# EAGLE design Ring Controller (EAGLE 9.6.2)
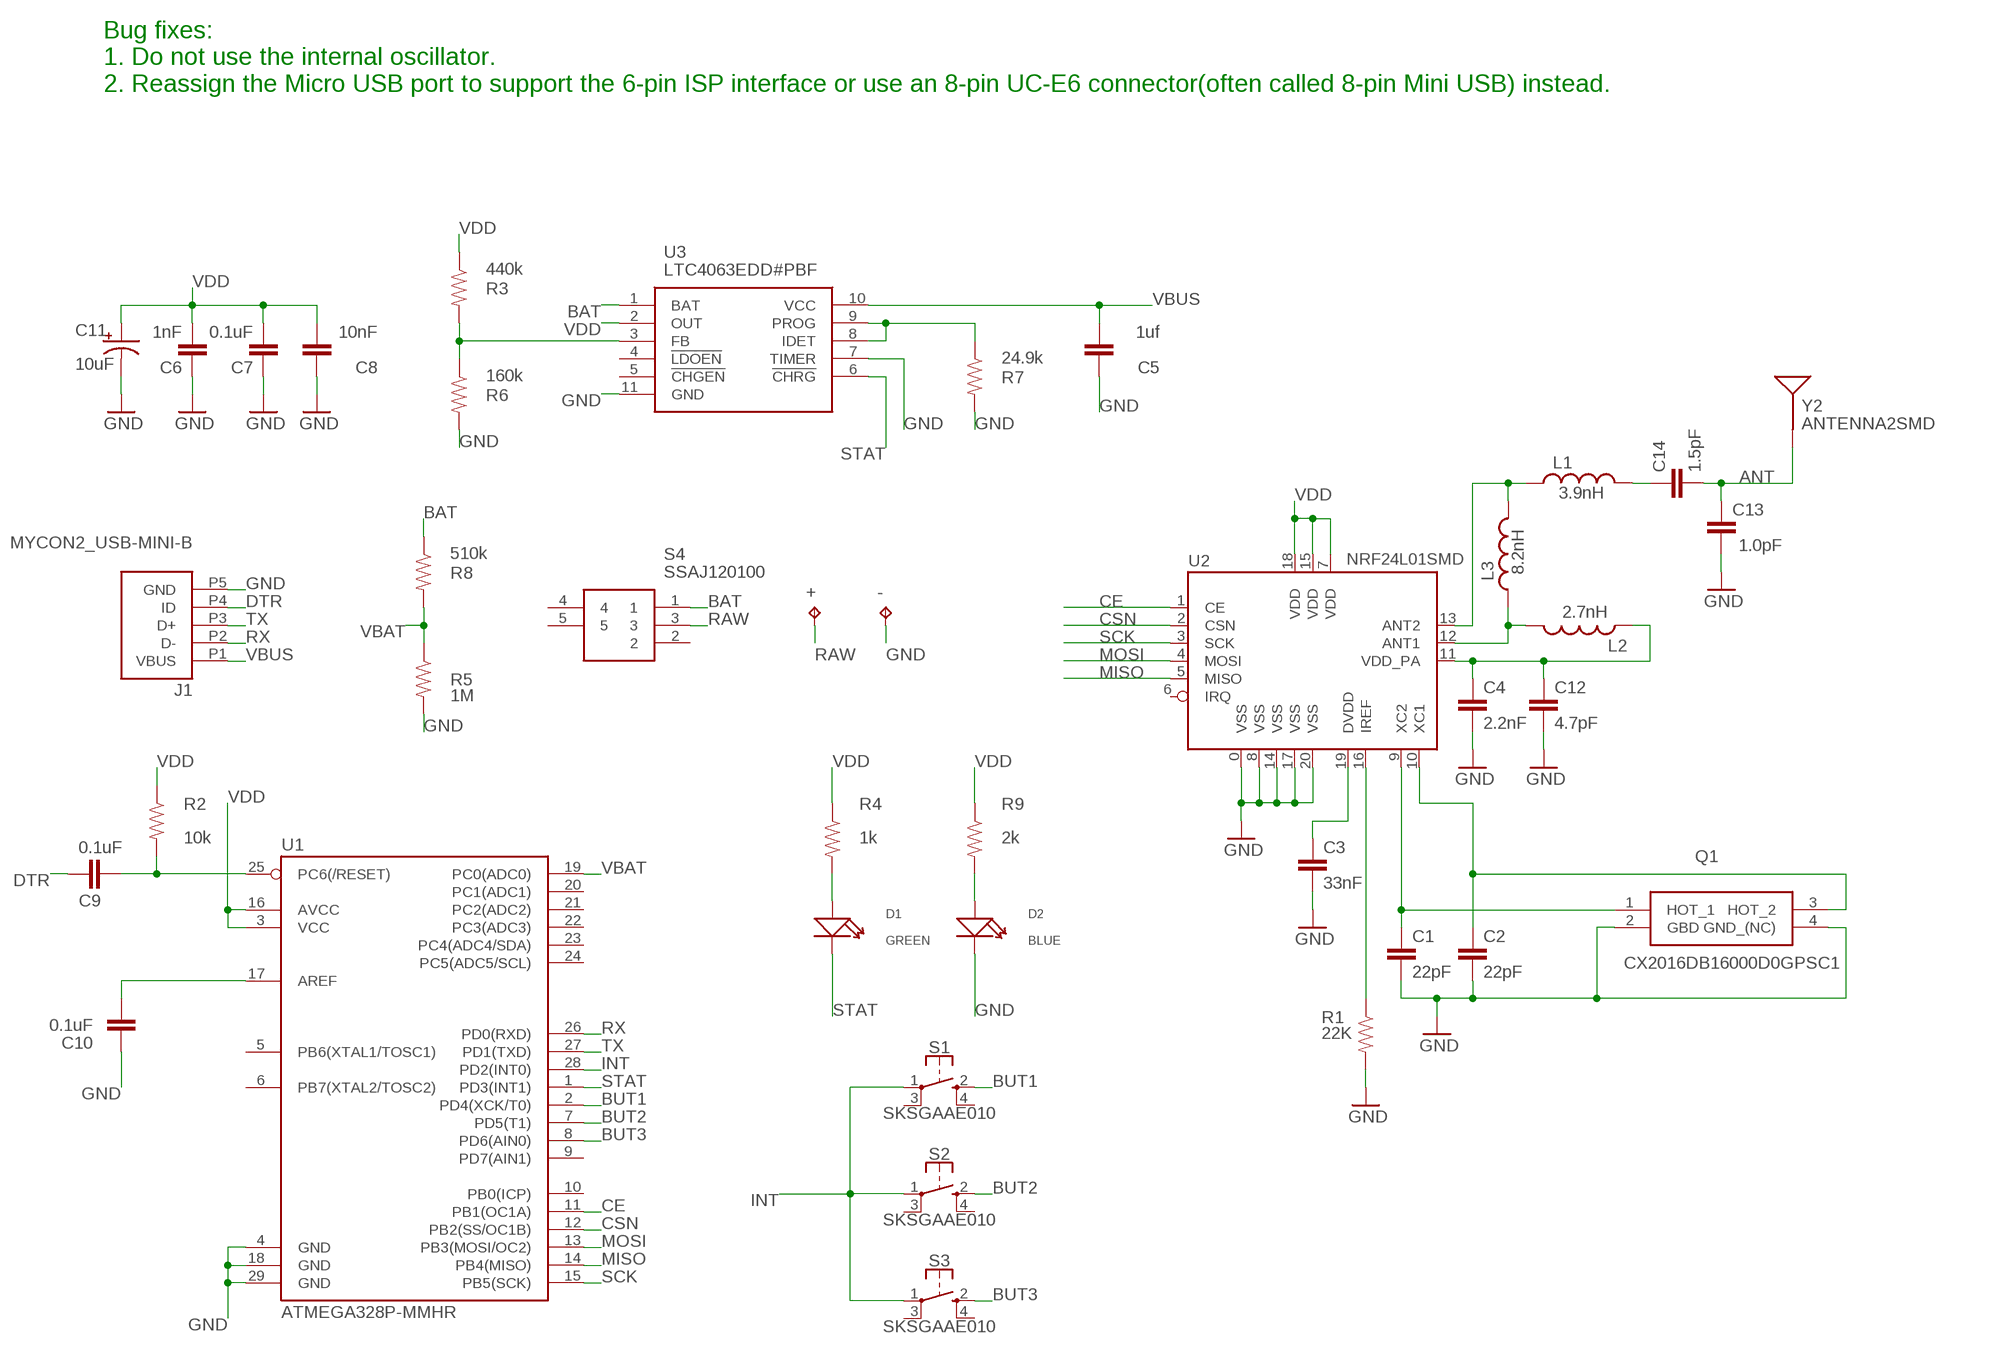
[diagram p0: schematic, sheet 1]

## Parts
+  TPB1,27  [B1,27]
-  TPB1,27  [B1,27]
C1  22pF  CAP0402-CAP  [0402-CAP]
C2  22pF  CAP0402-CAP  [0402-CAP]
C3  33nF  CAP0402-CAP  [0402-CAP]
C4  2.2nF  CAP0402-CAP  [0402-CAP]
C5  1uf  CAP0402-CAP  [0402-CAP]
C6  1nF  CAP0402-CAP  [0402-CAP]
C7  0.1uF  CAP0402-CAP  [0402-CAP]
C8  10nF  CAP0402-CAP  [0402-CAP]
C9  0.1uF  CAP0402-CAP  [0402-CAP]
C10  0.1uF  CAP0402-CAP  [0402-CAP]
C11  10uF  10UF-POLAR-0603-6.3V-20%(TANT)  [0603-POLAR]
C12  4.7pF  CAP0402-CAP  [0402-CAP]
C13  1.0pF  CAP0402-CAP  [0402-CAP]
C14  1.5pF  CAP0402-CAP  [0402-CAP]
D1  GREEN  SMD-LED-CLEAR-BLUE(0402)  [LED-0402]
D2  BLUE  SMD-LED-CLEAR-BLUE(0402)  [LED-0402]
J1  MYCON2_USB-MINI-B  [CON2_USB_MICRO_B_AT]
L1  3.9nH  INDUCTOR0402  [C0402]
L2  2.7nH  INDUCTOR0402  [C0402]
L3  8.2nH  INDUCTOR0402  [C0402]
Q1  CX2016DB16000D0GPSC1  [CX2016DB_1]
R1  22K  RESISTOR0402-RES  [0402-RES]
R2  10k  RESISTOR0402  [0402-RES]
R3  440k  RESISTOR0402  [0402-RES]
R4  1k  RESISTOR0402  [0402-RES]
R5  1M  RESISTOR0402  [0402-RES]
R6  160k  RESISTOR0402  [0402-RES]
R7  24.9k  RESISTOR0402  [0402-RES]
R8  510k  RESISTOR0402  [0402-RES]
R9  2k  RESISTOR0402  [0402-RES]
S1  SKSGAAE010  [SKSG]
S2  SKSGAAE010  [SKSG]
S3  SKSGAAE010  [SKSG]
S4  SSAJ120100  [SSAJ120100]
U1  ATMEGA328P-MMHR  [QFN45P400X400X100-29N]
U2  NRF24L01SMD  [QFN20-4X4MM]
U3  LTC4063EDD#PBF  [SON50P300X300X80-11N]
Y2  ANTENNA2SMD  [ANTENNA-CHIP2]

## Nets
ANT: C13.2 C14.2 Y2.FEED(SIGNAL)
BAT: R8.1 S4.1 U3.1(BAT)
BUT1: S1.2 U1.2(PD4(XCK/T0))
BUT2: S2.2 U1.7(PD5(T1))
BUT3: S3.2 U1.8(PD6(AIN0))
CE: U1.11(PB1(OC1A)) U2.1(CE)
CSN: U1.12(PB2(SS/OC1B)) U2.2(CSN)
DTR: C9.1 J1.P4(ID)
GND: -.TP C1.2 C2.2 C3.2 C4.2 C5.1 C6.1 C7.1 C8.1 C10.1 C11.- C12.2 C13.1 D2.- J1.P5(GND) Q1.2(GBD) Q1.4(GND_(NC)) R1.2 R5.2 R6.2 R7.2 U1.4(GND) U1.18(GND) U1.29(GND) U2.0(VSS) U2.8(VSS) U2.14(VSS) U2.17(VSS) U2.20(VSS) U3.7(TIMER) U3.11(GND)
INT: S1.1 S2.1 S3.1 U1.28(PD2(INT0))
MISO: U1.14(PB4(MISO)) U2.5(MISO)
MOSI: U1.13(PB3(MOSI/OC2)) U2.4(MOSI)
N$1: C1.1 Q1.1(HOT_1) U2.9(XC2)
N$2: C2.1 Q1.3(HOT_2) U2.10(XC1)
N$3: L2.2 L3.1 U2.12(ANT1)
N$4: R1.1 U2.16(IREF)
N$5: C3.1 U2.19(DVDD)
N$6: L1.1 L3.2 U2.13(ANT2)
N$7: C4.1 C12.1 L2.1 U2.11(VDD_PA)
N$8: D1.+ R4.2
N$9: D2.+ R9.2
N$10: C14.1 L1.2
N$11: C10.2 U1.17(AREF)
N$12: R3.2 R6.1 U3.3(FB)
N$13: R7.1 U3.8(IDET) U3.9(PROG)
RAW: +.TP S4.3
RST: C9.2 R2.2 U1.25(PC6(/RESET))
RX: J1.P2(D-) U1.26(PD0(RXD))
SCK: U1.15(PB5(SCK)) U2.3(SCK)
STAT: D1.- U1.1(PD3(INT1)) U3.6(!CHRG)
TX: J1.P3(D+) U1.27(PD1(TXD))
VBAT: R5.1 R8.2 U1.19(PC0(ADC0))
VBUS: C5.2 J1.P1(VBUS) U3.10(VCC)
VDD: C6.2 C7.2 C8.2 C11.+ R2.1 R3.1 R4.1 R9.1 U1.3(VCC) U1.16(AVCC) U2.7(VDD) U2.15(VDD) U2.18(VDD) U3.2(OUT)
Unconnected: S1.3 S1.4 S2.3 S2.4 S3.3 S3.4 S4.2 S4.4 S4.5 U1.5(PB6(XTAL1/TOSC1)) U1.6(PB7(XTAL2/TOSC2)) U1.9(PD7(AIN1)) U1.10(PB0(ICP)) U1.20(PC1(ADC1)) U1.21(PC2(ADC2)) U1.22(PC3(ADC3)) U1.23(PC4(ADC4/SDA)) U1.24(PC5(ADC5/SCL)) U2.6(IRQ) U3.4(!LDOEN) U3.5(!CHGEN)

## Notes on the sheet
- Bug fixes:
  1. Do not use the internal oscillator.
  2. Reassign the Micro USB port to support the 6-pin ISP interface or use an 8-pin UC-E6 connector(often called 8-pin Mini USB) instead.

## Library data of the parts
+ - = testpad:TP: Test pad
C1-C4 C12-C14 = SparkFun:CAP: Capacitor Standard 0603 ceramic capacitor, and 0.1" leaded capacitor.
C5-C10 = SparkFun-Passives:CAP: Capacitor Standard 0603 ceramic capacitor, and 0.1" leaded capacitor.; PROD_ID: CAP-00868
C11 = SparkFun-Capacitors:10UF-POLAR: 10.0µF polarized capacitors A capacitor is a passive two-terminal electrical component used to store electrical energy temporarily in an electric field.; PROD_ID: CAP-13210
D1 D2 = Seeed-LED:SMD-LED-CLEAR-BLUE(0402): 304090075; MPN: BL-HB337A-AV-TRB; VALUE: BLUE-0402
J1 = SmartPrj:MYCON2_USB-MINI-B; SPICEPREFIX: X
L1-L3 = SparkFun:INDUCTOR: Inductors Basic Inductor/Choke - 0603 and 1206. Footprints are not proven and vary greatly between part numbers.
Q1 = 2016xtal:CX2016DB16000D0GPSC1: Crystals AEC-Q200 16MHz 8pF 2x1.6mm Source: Datasheet <http://media.digikey.com/pdf/Data Sheets/AVX PDFs/CX2016DB_USY1M-H1-16425-00_Spec.pdf>; DESCRIPTION: Crystals AEC-Q200 16MHz 8pF 2x1.6mm; HEIGHT: mm; MANUFACTURER_NAME: AVX; MANUFACTURER_PART_NUMBER: CX2016DB16000D0GPSC1; MOUSER_PART_NUMBER: 581-CX2016DB16000DPS; MOUSER_PRICE-STOCK: https://www.mouser.com/Search/Refine.aspx?Keyword=581-CX2016DB16000DPS
R1 = SparkFun:RESISTOR: Resistor Basic schematic elements and footprints for 0603, 1206, and PTH resistors.
R2-R9 = SparkFun-Resistors:RESISTOR: Resistor Basic schematic elements and footprints for 0603, 1206, and PTH resistors.; PROD_ID: RES-08698
S1-S3 = SKSGAAE010:SKSGAAE010: Black Button Tactile Switch, SPST-NO 50 mA 0.4mm Surface Mount Source: Datasheet <http://uk.rs-online.com/web/p/products/9173829>; DESCRIPTION: Black Button Tactile Switch, SPST-NO 50 mA 0.4mm Surface Mount; HEIGHT: mm; MANUFACTURER_NAME: ALPS; MANUFACTURER_PART_NUMBER: SKSGAAE010; MOUSER_PART_NUMBER: 688-SKSGAAE010; MOUSER_PRICE-STOCK: https://www.mouser.com/Search/Refine.aspx?Keyword=688-SKSGAAE010
S4 = SSAJ120100:SSAJ120100: Slide Switches 1-pole 2-positions Surface Mount Slide Switch SPDT Maintained 10 mA Slide Source: Datasheet <http://www.farnell.com/datasheets/1582290.pdf>; DESCRIPTION: Slide Switches 1-pole 2-positions Surface Mount Slide Switch SPDT Maintained 10 mA Slide; HEIGHT: mm; MANUFACTURER_NAME: ALPS; MANUFACTURER_PART_NUMBER: SSAJ120100; MOUSER_PART_NUMBER: 688-SSAJ120100; MOUSER_PRICE-STOCK: https://www.mouser.com/Search/Refine.aspx?Keyword=688-SSAJ120100; RS_PART_NUMBER: 1238892; RS_PRICE-STOCK: http://uk.rs-online.com/web/p/products/1238892
U1 = ATMEGA328P-MMHR:ATMEGA328P-MMHR: 8-bit Microcontrollers - MCU AVR 32K FL 2K SRAM 1KB EE 20 MHZ GRN Source: Datasheet <http://ww1.microchip.com/downloads/en/DeviceDoc/Atmel-42735-8-bit-AVR-Microcontroller-ATmega328-328P_Summary.pdf>; DESCRIPTION: 8-bit Microcontrollers - MCU AVR 32K FL 2K SRAM 1KB EE 20 MHZ GRN; HEIGHT: 1mm; MANUFACTURER_NAME: Microchip; MANUFACTURER_PART_NUMBER: ATMEGA328P-MMHR; MOUSER_PART_NUMBER: 556-ATMEGA328P-MMHR; MOUSER_PRICE-STOCK: https://www.mouser.com/Search/Refine.aspx?Keyword=556-ATMEGA328P-MMHR
U2 = SparkFun-RF:NRF24L01: Nordic nrf24L01 2.4GHz Low-power Transceiver This is the very popular, low cost, very low power RF transceiver from Nordic Semiconductor. Simple SPI interface. SparkFun Products 2.4GHz Transceiver IC - nRF24L01+ <https://www.sparkfun.com/products/690> (COM-00690) SparkFun Transceiver Breakout - nRF24L01+ (RP-SMA) <https://www.sparkfun.com/products/705> (WRL-00705) SparkFun Transceiver Breakout - nRF24L01+ <https://www.sparkfun.com/products/691> (COM-00691); PROD_ID: IC-08950; SF_ID: COM-00690
U3 = LTC4063EDD#PBF:LTC4063EDD#PBF: LINEAR TECHNOLOGY - LTC4063EDD#PBF - IC, BATT CHARGER, W/MP LDO, 10DFN Source: Datasheet <http://cds.linear.com/docs/en/datasheet/4063fc.pdf>; DESCRIPTION: LINEAR TECHNOLOGY - LTC4063EDD#PBF - IC, BATT CHARGER, W/MP LDO, 10DFN; HEIGHT: 0.8mm; MANUFACTURER_NAME: Linear Technology; MANUFACTURER_PART_NUMBER: LTC4063EDD#PBF; MOUSER_PART_NUMBER: 584-LTC4063EDD#PBF; MOUSER_PRICE-STOCK: https://www.mouser.com/Search/Refine.aspx?Keyword=584-LTC4063EDD%23PBF
Y2 = SparkFun:ANTENNA2: Antenna Single endded antenna. Common with smaller chip antennas. CHIP4 package is the GPS Chip Antenna SKU: GPS-08418. CHIP5 package is 2.4GHz chip antenna SKU: WRL-00144.

## Net classes
0 sig: width 0.127 mm, drill 0.2 mm, clearance 0.089 mm

## Board
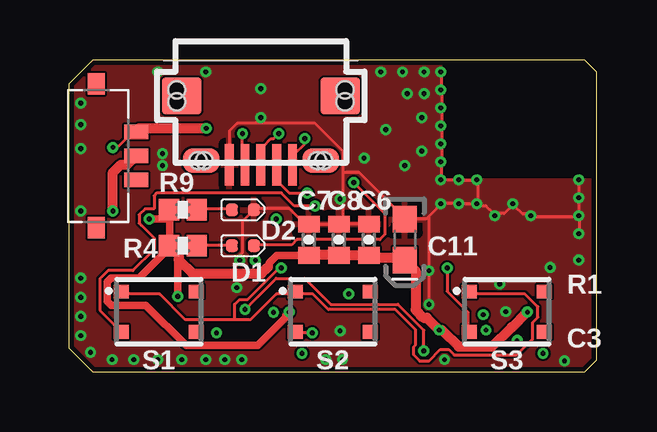
[diagram p1: board, top side]
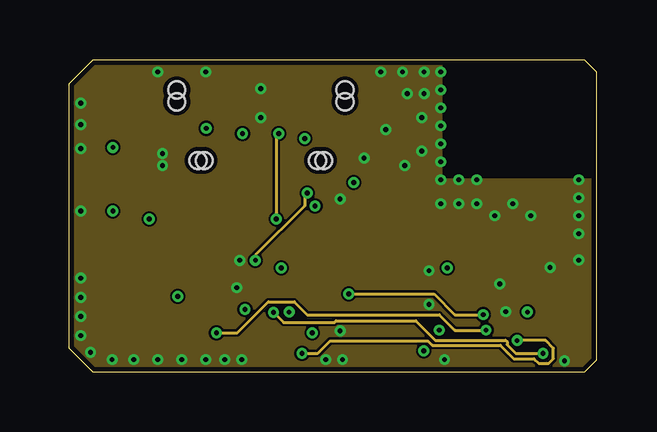
[diagram p2: board, inner layer Route2]
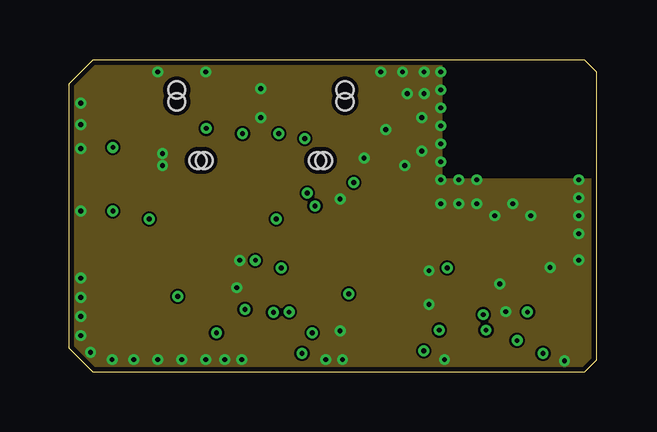
[diagram p3: board, inner layer Route15]
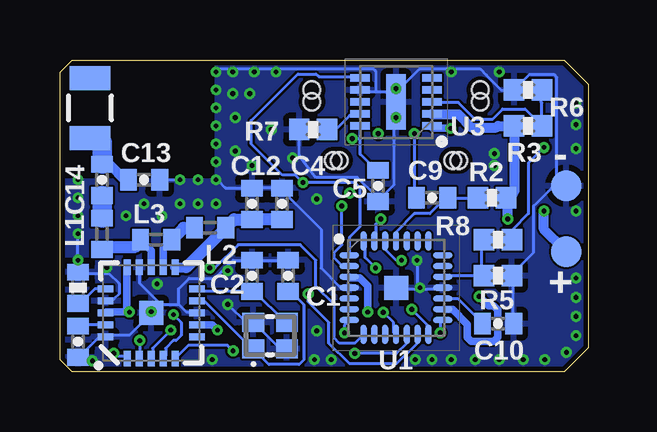
[diagram p4: board, bottom side, seen from below]

Size 22 x 13 mm. Coordinates in mm from the lower left corner, seen from the top.
Outline: 1,0 21.5,0 22,0.5 22,12.5 21.5,13 1,13 0,12 0,1 1,0
Copper layers (1+2*15+16): Top 0.035mm / dielectric 0.1mm / Route2 0.01mm / dielectric 0.61mm / Route15 0.01mm / dielectric 0.1mm / Bottom 0.035mm
Design rules "default *": minimum track width 3.5mil, minimum drill 0.2mm, track to track 3.5mil, track to pad 5mil, pad to pad 5mil, via to via 5mil, smd to smd 0mil, copper to edge 8mil, drill to drill 10mil, minimum pad ring 5mil, minimum via ring 5mil, stop-mask expansion 4mil, vias tented up to drill 8mil, thermal gap 10mil

### Footprints (pad centres in the part's own frame; a part is rotated, then mirrored left to right if it is on the bottom)
B1,27 = smd 1.27 x 1.27: TP 0,0
0402-CAP = smd 0.7 x 0.9: 1 -0.65,0; 2 0.65,0
0603-POLAR = smd 1.1 x 1: + 0.85,0; - -0.85,0
LED-0402 = smd 0.5 x 0.5: + -0.463,0; - 0.463,0
CON2_USB_MICRO_B_AT = smd 0.406 x 1.727: P1 -1.321,2.87; P2 -0.66,2.87; P3 0,2.87; P4 0.66,2.87; P5 1.321,2.87 | smd 1.651 x 1.549: S1 -3.302,0; S2 3.302,0 | smd 1.524 x 1.016: S3 -2.489,2.692; S4 2.489,2.692 | hole 0.7: -3.505,0.254; -3.505,-0.254; 3.505,0.254; 3.505,-0.254; -2.616,2.692; -2.362,2.692; 2.362,2.692; 2.616,2.692
C0402 = smd 0.7 x 0.9: 1 -0.65,0; 2 0.65,0
CX2016DB_1 = smd 0.9 x 0.8: 1 -0.7,-0.55; 2 0.7,-0.55; 3 0.7,0.55; 4 -0.7,0.55
0402-RES = smd 0.7 x 0.9: 1 -0.65,0; 2 0.65,0
0402-RES' = smd 0.85 x 0.9: 1 -0.58,0; 2 0.58,0
SKSG = smd 0.625 x 0.575: 1 -1.562,0.838; 2 -1.562,-0.838; 3 1.562,0.838; 4 1.562,-0.838
SSAJ120100 = smd 0.6 x 1: 1 0,0.302; 2 2,0.3; 3 1,0.3 | smd 0.9 x 0.7: 4 -2,-1.355; 5 4,-1.355
QFN45P400X400X100-29N = smd 0.8 x 0.25: 1 -1.95,1.35; 2 -1.95,0.9; 3 -1.95,0.45; 4 -1.95,0; 5 -1.95,-0.45; 6 -1.95,-0.9; 7 -1.95,-1.35; 15 1.95,-1.35; 16 1.95,-0.9; 17 1.95,-0.45; 18 1.95,0; 19 1.95,0.45; 20 1.95,0.9; 21 1.95,1.35 | smd 0.25 x 0.8: 8 -1.35,-1.95; 9 -0.9,-1.95; 10 -0.45,-1.95; 11 0,-1.95; 12 0.45,-1.95; 13 0.9,-1.95; 14 1.35,-1.95; 22 1.35,1.95; 23 0.9,1.95; 24 0.45,1.95; 25 0,1.95; 26 -0.45,1.95; 27 -0.9,1.95; 28 -1.35,1.95 | smd 1 x 1: 29 0,0
QFN20-4X4MM = smd 1 x 1: 0 0,0 | smd 0.65 x 0.3: 1 -1.9,1; 2 -1.9,0.5; 3 -1.9,0; 4 -1.9,-0.5; 5 -1.9,-1; 11 1.9,-1; 12 1.9,-0.5; 13 1.9,0; 14 1.9,0.5; 15 1.9,1 | smd 0.3 x 0.65: 6 -1,-1.9; 7 -0.5,-1.9; 8 0,-1.9; 9 0.5,-1.9; 10 1,-1.9; 16 1,1.9; 17 0.5,1.9; 18 0,1.9; 19 -0.5,1.9; 20 -1,1.9
SON50P300X300X80-11N = smd 0.8 x 0.3: 1 -1.5,1; 2 -1.5,0.5; 3 -1.5,0; 4 -1.5,-0.5; 5 -1.5,-1; 6 1.5,-1; 7 1.5,-0.5; 8 1.5,0; 9 1.5,0.5; 10 1.5,1 | smd 0.8 x 2.3: 11 0,0
ANTENNA-CHIP2 = smd 1.7 x 1: FEED 0,1.25; P$2 0,-1.25

### Placement (x,y rotation side)
+  0.9,5 0 bottom
-  0.9,7.75 0 bottom
C1  12.5,4 90 bottom
C2  14,4 90 bottom
C3  21.25,1.25 270 bottom
C4  12.75,7 90 bottom
C5  8.75,7.75 90 bottom
C6  12.5,5.5 270 top
C7  10,5.5 270 top
C8  11.25,5.5 270 top
C9  6.5,7.25 0 bottom
C10  3.75,2 180 bottom
C11  14,5.5 270 top
C12  14,7 90 bottom
C13  18.5,8 180 bottom
C14  20.25,8 90 bottom
D1  7.25,5.25 0 top
D2  7.25,6.75 0 top
J1  8,11.5 180 top
L1  20.25,5.75 90 bottom
L2  15.75,6 180 bottom
L3  18,5.5 180 bottom
Q1  13.25,1.5 0 bottom
R1  21.25,3.5 90 bottom
R2  10k  [0402-RES']  4,7.25 180 bottom
R3  440k  [0402-RES']  2.5,10.25 0 bottom
R4  1k  [0402-RES']  4.75,5.25 0 top
R5  1M  [0402-RES']  3.75,4 0 bottom
R6  160k  [0402-RES']  2.5,11.75 180 bottom
R7  24.9k  [0402-RES']  11.45,10.1 180 bottom
R8  510k  [0402-RES']  3.75,5.5 180 bottom
R9  2k  [0402-RES']  4.75,6.75 0 top
S1  3.75,2.5 0 top
S2  11,2.5 0 top
S3  18.25,2.5 0 top
S4  2.5,10 270 top
U1  8,3.5 0 bottom
U2  18.2,2.45 90 bottom
U3  8,11.25 180 bottom
Y2  20.75,11 180 bottom

### Tracks (layer width: path | path; a pad name or v marks a point on that pad's centre or on a via)
ANT
  Bottom 0.305: Y2.FEED 20.45,9.75 20.25,9.55 | C13.2 19.3,8 | 19.95,8.65 C14.2
  Bottom 0.406: 19.95,8.65 19.3,8
  Bottom 0.813: C14.2 20.25,9.55
BAT  (via drill 0.2)
  Top 0.127: 2.92,10.15 2.81,10.04 S4.1 2.7,10.04 2.01,9.35 v1.83,9.35
  Top 0.406: 2.92,10.15 v5.72,10.15
  Bottom 0.127: 6.48,10.15 U3.1 | v1.83,9.35 2.48,8.7 2.48,6.58 3.13,5.94 3.13,5.5 R8.1
  Bottom 0.305: v5.72,10.15 6.48,10.15
BUT1  (via drill 0.2)
  Top 0.127: v10.26,6.91 9.39,6.91 8.85,7.45 3.67,7.45 3.55,7.33 3.55,6.8 3.54,6.79 3.17,6.79 2.93,6.54 2.93,6.2 3.01,6.11 3.55,5.57 3.55,5.1 2.66,4.21 1.63,4.21 1.29,3.87 1.29,2.56 S1.2
  Bottom 0.127: v10.26,6.91 10.26,5.29 10.58,4.97 10.58,4.75 10.26,4.43 10.04,4.43 U1.2
BUT2  (via drill 0.2)
  Top 0.127: v10.15,1.62 9.5,1.62 S2.2
  Bottom 0.127: v10.15,1.62 10.15,1.94 10.04,2.05 U1.7
BUT3  (via drill 0.2)
  Top 0.127: v15.76,4.32 15.76,3.35 16.62,2.48 16.62,1.73 S3.2
  Bottom 0.127: v15.76,4.32 15.54,4.32 14.57,5.29 11.98,5.29 11.34,4.64 11.34,3.56 10.58,2.81 10.58,1.4 10.36,1.19 9.72,1.19 9.39,1.51 U1.8
CE  (via drill 0.2)
  Route2 0.127: v8.53,2.48 8.95,2.05 | 8.95,2.05 | 8.95,2.05 11.06,2.05 11.13,2.12 14.46,2.12 15.26,1.31 18.19,1.31 18.26,1.24 18.26,1.12 18.62,0.76 v19.75,0.76
  Bottom 0.127: v19.75,0.76 19.65,0.65 19.21,0.65 U2.1 | v8.53,2.48 8.1,2.04 8.1,1.62 U1.11
CSN  (via drill 0.2)
  Route2 0.127: v18.68,1.29 19.86,1.29 20.19,0.97 20.19,0.54 19.97,0.32 19.96,0.34 19.58,0.34 19.38,0.54 18.54,0.54 17.98,1.09 15.15,1.09 14.96,1.28 10.89,1.28 10.37,0.76 v9.72,0.76
  Bottom 0.127: v18.68,1.29 18.68,0.65 U2.2 | v9.72,0.76 7.99,0.76 7.56,1.19 7.56,1.51 U1.12
DTR  (via drill 0.2)
  Top 0.127: v7.23,9.93 7.23,8.64 J1.P4
  Bottom 0.127: v7.23,9.93 7.23,7.34 C9.1
GND  (via drill 0.2)
  Top 0.127: 11.44,6.15 12.41,6.15 C6.1 | 11.44,6.15 11.34,6.15 C8.1 | C8.1 11.23,6.15 10.04,6.15 C7.1 9.93,6.04 9.18,6.8 7.77,6.8 D2.- 7.66,6.69 7.23,6.26 7.23,4.97 7.12,4.86 v7.12,4.64 | 11.44,6.15 11.44,8.31 | 11.44,8.31 11.44,9.18 10.26,10.36 7.02,10.36 6.69,10.04 6.69,8.64 J1.P5 | 11.44,6.15 C8.1 | v15.5,12.5 15.54,12.41 15.54,11.77 v15.5,11.75 15.54,11.66 15.54,11.01 v15.5,11 15.54,10.9 15.54,10.26 v15.5,10.25 15.54,10.15 15.54,9.61 v15.5,9.5 15.54,9.5 15.54,8.85 v15.5,8.75 15.54,8.74 15.54,8.1 v15.5,8 15.54,7.99 16.19,7.99 v16.25,8 16.3,7.99 16.95,7.99 v17,8 17.06,7.99 17.06,7.02 v17,7 | v21.25,5.75 21.27,5.83 21.27,6.48 v21.25,6.5 | v21.25,6.5 21.27,6.58 21.27,7.23 v21.25,7.25 21.27,7.34 21.27,7.99 v21.25,8 | v17,7 16.95,7.02 16.3,7.02 v16.25,7 16.19,7.02 15.54,7.02 v15.5,7 15.44,6.91 15.01,6.48 | v17,7 17.06,6.91 17.38,6.91 17.7,6.58 v17.75,6.5 17.81,6.58 18.14,6.58 18.46,6.91 v18.5,7 18.57,6.91 18.89,6.58 19.21,6.58 v19.25,6.5 19.32,6.48 21.16,6.48 v21.25,6.5 | 14.03,6.37 14.9,6.37 15.01,6.48 | 15.01,6.48 v15.01,4.21 v15.01,2.81 | 11.44,8.31 12.09,8.31 14.03,6.37 | 14.03,6.37 C11.-
  Bottom 0.127: C10.1 3.13,2.05 3.13,3.99 R5.2 3.13,4.1 2.27,4.97 2.27,6.91 1.51,7.66 1.29,7.66 | 1.29,7.66 0.97,7.66 -.TP 1.29,7.66 | 8.85,11.66 8.42,11.66 8.2,11.44 | 8.85,11.66 9.5,11.66 U3.7 | 8.2,11.44 8.1,11.34 U3.11 | U3.11 8.1,11.23 8.1,7.77 8.74,7.12 C5.1 8.85,7.12 8.85,7.34 9.61,8.1 11.34,8.1 12.03,9.01 R7.2 | 8.2,11.44 7.02,12.63 4.5,12.63 4.24,12.37 3.62,11.75 R6.2 2.44,12.39 1.42,12.39 1.29,12.27 1.29,7.66 | 8.2,11.44 U3.11 | C3.2 21.16,0.65 20.4,1.4 20.19,1.4 U2.20 20.08,1.51 19.11,1.51 18.24,2.38 U2.0 | C1.2 12.52,4.64 13.93,4.64 C2.2 14.03,4.64 14.79,4.64 15.11,4.32 | 17.06,2.81 16.73,2.48 16.3,2.48 U2.8 | 17.81,2.81 17.06,2.81 | 17.81,2.81 18.14,2.48 U2.0 | 17.81,2.81 18.68,3.67 18.68,4.32 U2.14 | 17.81,2.81 U2.0 | 15.11,4.32 15.54,3.89 16.62,3.89 17.06,3.45 17.06,2.81 | 7.12,3.45 7.99,3.45 U1.29 | 7.12,3.45 6.15,3.45 U1.18 | v7.12,4.64 7.12,3.45 | U1.4 10.04,3.56 10.36,3.56 11.12,4.32 11.12,5.94 12.74,7.56 C4.2 12.85,7.66 13.93,7.66 C12.2 14.03,7.66 15.11,7.66 15.44,7.99 v15.5,8 | C13.1 17.81,7.99 17.06,7.99 v17,8 | U2.17 20.08,3.02 19.75,3.02 19.54,3.24 19.54,3.67 19.97,4.1 21.16,4.1 R1.2 21.27,4.21 21.27,5.72 v21.25,5.75 | Q1.2 12.63,0.97 12.85,0.97 13.93,2.05 Q1.4 14.03,2.05 14.25,2.05 v15.01,2.81 | v15.01,4.21 15.11,4.32 | 8.85,11.66 8.85,12.52 8.96,12.63 15.33,12.63 15.44,12.52 v15.5,12.5
  other vias: 18.2,2.5 14.8,12.5 13,12.5 13.9,12.5 8,11.8 14.1,11.6 14.8,11.6 14.7,10.6 14.7,9.2 14,8.6 12.3,8.9 5.7,12.5 3.7,12.5 0.5,11.2 0.5,10.3 0.5,9.3 0.5,6.7 0.5,3.9 0.5,3.1 0.5,2.3 0.5,1.5 0.9,0.8 1.8,0.5 2.7,0.5 3.7,0.5 4.7,0.5 5.7,0.5 7.2,0.5 6.5,0.5 11.3,7.2 7,3.5 17.96,3.66 20.05,4.35 20.65,0.45 8,10.6 10.7,0.5 11.4,0.5 11.3,1.7 15.65,0.5 21.25,4.65 13.2,10.1 3.9,9.1 3.9,8.6
  pour Top: -0.5,13.5 -0.5,-0.5 22.5,-0.5 22.5,8 15.5,8 15.5,13.5
  pour Route2: -1,14 -1,-1 23,-1 23,8 15.5,8 15.5,14
  pour Route15: -1.5,14.5 -1.5,-1.5 23.5,-1.5 23.5,8 15.5,8 15.5,14.5
  pour Bottom: -2,15 -2,-2 24,-2 24,8 15.5,8 15.5,15
INT  (via drill 0.2)
  Top 0.127: 6.91,2.16 7.56,2.16 8.64,3.24 9.39,3.24 S2.1 9.5,3.24 10.17,3.24 10.81,2.59 13.6,2.59 14.45,1.74 14.45,1.11 14.37,1.04 14.37,0.69 14.62,0.45 15.01,0.45 15.48,0.92 15.82,0.92 16.05,0.69 18.66,0.69 19.31,1.34 19.31,2.04 19.54,2.27 19.54,2.7 19,3.24 16.73,3.24 S3.1 | 6.91,2.16 4.86,2.16 3.78,3.24 2.27,3.24 S1.1 | 6.91,2.16 6.91,2.81 7.11,3.01 7.45,3.01 8.77,4.33 v8.85,4.33
  Bottom 0.127: v8.85,4.33 9.28,4.76 9.28,5.4 U1.28
MISO  (via drill 0.2)
  Top 0.127: v14.79,0.86 14.79,1.72 13.71,2.81 10.9,2.81 9.82,3.89 8.64,3.89 v7.34,2.59
  Bottom 0.127: v7.34,2.59 6.69,1.94 6.69,1.62 U1.14 | 17.16,0.65 U2.5 16.65,1.1 15.03,1.1 v14.79,0.86
MOSI  (via drill 0.2)
  Route2 0.127: v17.27,2.38 16.09,2.38 15.22,3.24 v11.66,3.24
  Bottom 0.127: v17.27,2.38 16.95,2.05 16.95,1.51 17.16,1.29 17.27,1.29 17.6,0.97 17.6,0.65 U2.4 | v11.66,3.24 11.66,2.92 10.79,2.05 10.79,1.19 9.93,0.32 7.99,0.32 7.12,1.19 7.12,1.51 U1.13
N$1
  Bottom 0.127: U2.9 16,2.95 14,0.95 Q1.1 13.3,0.3 12.04,0.3 11.85,0.49 11.85,2.8 12.4,3.35 C1.1
N$2
  Bottom 0.127: Q1.3 12.6,2.05 13.9,3.35 C2.1 16.2,3.35 U2.10
N$3
  Bottom 0.305: U2.12 17.7,5.15 L3.1
  Bottom 0.508: L3.1 16.85,6 L2.2
N$4
  Bottom 0.127: U2.16 20.55,3.45 21.15,2.85 R1.1
N$5
  Bottom 0.127: U2.19 21.2,1.95 C3.1
N$6
  Bottom 0.305: L1.1 20.15,5.2 | 18.85,5.2 18.65,5.4 L3.2 18.2,5.05 U2.13
  Bottom 0.508: 20.15,5.2 18.85,5.2
N$7
  Bottom 0.305: 15.1,5.9 L2.1
  Bottom 0.406: U2.11 16.75,4.35
  Bottom 0.508: C4.1 C12.1 14.75,6.35 L2.1 16.75,4.35
N$8
  Top 0.127: D1.+ 6.69,5.29 5.4,5.29 R4.2
N$9
  Top 0.127: D2.+ 6.69,6.8 5.4,6.8 R9.2
N$10
  Bottom 0.813: L1.2 C14.1
N$11
  Bottom 0.127: U1.17 6.04,3.02 5.4,3.02 4.43,2.05 C10.2
N$12
  Bottom 0.127: U3.3 6.48,11.23 5.4,11.23 4.71,10.54 3.96,10.54 3.55,10.95 2.62,10.95 R3.2 1.92,11.2 1.94,11.23 1.94,11.73 R6.1
N$13
  Bottom 0.127: U3.8 9.5,11.23 9.5,10.79 U3.9 9.61,10.69 9.93,10.69 10.58,10.04 10.75,10.04 R7.1
RAW  (via drill 0.2)
  Top 0.127: 2.7,8.96 S4.3
  Top 0.406: S4.3 2.43,8.63 2.16,8.63 1.83,8.3 v1.83,6.69
  Bottom 0.127: 0.97,5.07 +.TP
  Bottom 0.406: v1.83,6.69 1.83,5.94 0.97,5.07
RST
  Bottom 0.127: U1.25 7.99,5.5 7.99,5.83 7.23,6.58 6.58,6.58 5.94,7.23 C9.2 5.83,7.23 4.64,7.23 R2.2
RX  (via drill 0.2)
  Top 0.127: v9.93,7.45 9.18,7.45 8.74,7.88 8.74,8.53 J1.P2
  Route2 0.127: v7.77,4.64 7.77,4.86 9.82,6.91 9.82,7.34 v9.93,7.45
  Bottom 0.127: v7.77,4.64 7.99,4.64 8.42,5.07 8.42,5.4 U1.26
SCK  (via drill 0.2)
  Route2 0.127: v17.38,1.73 16.09,1.73 15.44,2.38 9.93,2.38 9.39,2.92 8.31,2.92 7.02,1.62 v6.15,1.62
  Bottom 0.127: v17.38,1.73 18.14,0.97 18.14,0.65 U2.3 | v6.15,1.62 6.15,2.05 U1.15
STAT  (via drill 0.2)
  Top 0.127: v11.87,7.88 13.17,6.58 13.17,5.72 12.95,5.5 9.5,5.5 9.28,5.29 7.77,5.29 D1.-
  Bottom 0.127: U1.1 9.93,4.86 9.93,5.61 9.5,6.04 9.5,7.66 9.72,7.88 v11.87,7.88 12.2,8.2 12.74,8.2 14.03,9.5 14.03,10.47 12.09,12.41 11.34,12.41 11.23,12.31 9.61,12.31 U3.6
TX  (via drill 0.2)
  Top 0.127: v8.74,9.93 8.53,9.72 8.42,9.72 8.1,9.39 8.1,8.64 J1.P3
  Route2 0.127: v8.64,6.37 8.64,9.82 v8.74,9.93
  Bottom 0.127: v8.64,6.37 8.85,6.15 8.85,5.5 U1.27
VBAT
  Bottom 0.127: U1.19 6.04,3.99 4.43,3.99 R5.1 4.43,4.1 4.43,5.4 R8.2
VBUS  (via drill 0.2)
  Top 0.127: v9.82,9.72 9.82,9.5 9.39,9.07 9.39,8.64 J1.P1
  Bottom 0.127: 9.5,9.72 9.5,9.07 8.85,8.42 C5.2 | 9.5,9.72 9.5,10.15 U3.10 | v9.82,9.72 9.5,9.72
VDD  (via drill 0.2)
  Top 0.127: 10.04,4.86 C7.2 9.93,4.86 | 11.23,4.86 C8.2 11.34,4.86 | 12.41,4.86 C6.2 12.52,4.75 | 14.03,4.64 C11.+ 13.93,4.75 | 4.53,4.86 4.21,5.18 R4.1 4.21,5.29 | 4.21,6.37 4.21,6.69 R9.1 4.21,6.37
  Top 0.305: 4.53,4.86 v4.53,3.13 | 4.21,5.29 4.21,6.37 v3.35,6.37 | v9.18,2.48 9.03,2.34 9.03,2.27 7.87,1.1 4.88,1.1 3.21,2.77 1.76,2.77 1.6,2.93 1.6,3.74 1.76,3.9 2.93,3.9 4.21,5.18 | 8.29,4.35 8.35,4.4 8.35,4.54 8.66,4.85 C7.2
  Top 0.406: 11.23,4.86 10.04,4.86 | 11.34,4.86 12.41,4.86 | 13.93,4.75 12.52,4.75 | R4.1 4.58,4.84 4.58,4.66 5.15,4.08 8.03,4.08 8.29,4.35 | v19.11,2.48 18.48,1.85 18.45,1.85 17.64,1.04 16.24,1.04 15.56,1.73 v15.44,1.73 14.91,2.25 14.77,2.25 14.45,2.58 14.45,4.2 C11.+
  Bottom 0.127: 19.75,2.48 20.08,2.48 U2.18 | 19.21,4.32 U2.15 | 16.19,1.94 U2.7 | 6.48,10.69 U3.2 | 3.45,7.34 R2.1 3.35,7.23 | 3.45,10.32 R3.1 | 5.72,2.59 6,2.59 U1.16
  Bottom 0.305: U1.3 9.9,3.9 9.51,3.9 9.18,3.57 v9.18,2.48 | v4.53,3.13 4.13,2.73 3.93,2.73 3.77,2.57 3.77,1.43 3.93,1.27 4.87,1.27 5.03,1.43 5.03,1.98 5.64,2.59 6,2.59 | v15.44,1.73 15.65,1.94 16.19,1.94 | 20.08,2.48 v19.11,2.48 19.21,2.59 19.21,4.32
  Bottom 0.406: v3.35,6.37 3.35,7.23 3.08,7.5 R3.1 3.75,10.25 3.82,10.19 4.86,10.19 5.4,10.73 6.48,10.73 U3.2